# EAGLE design jlink-ob (EAGLE 6.4)
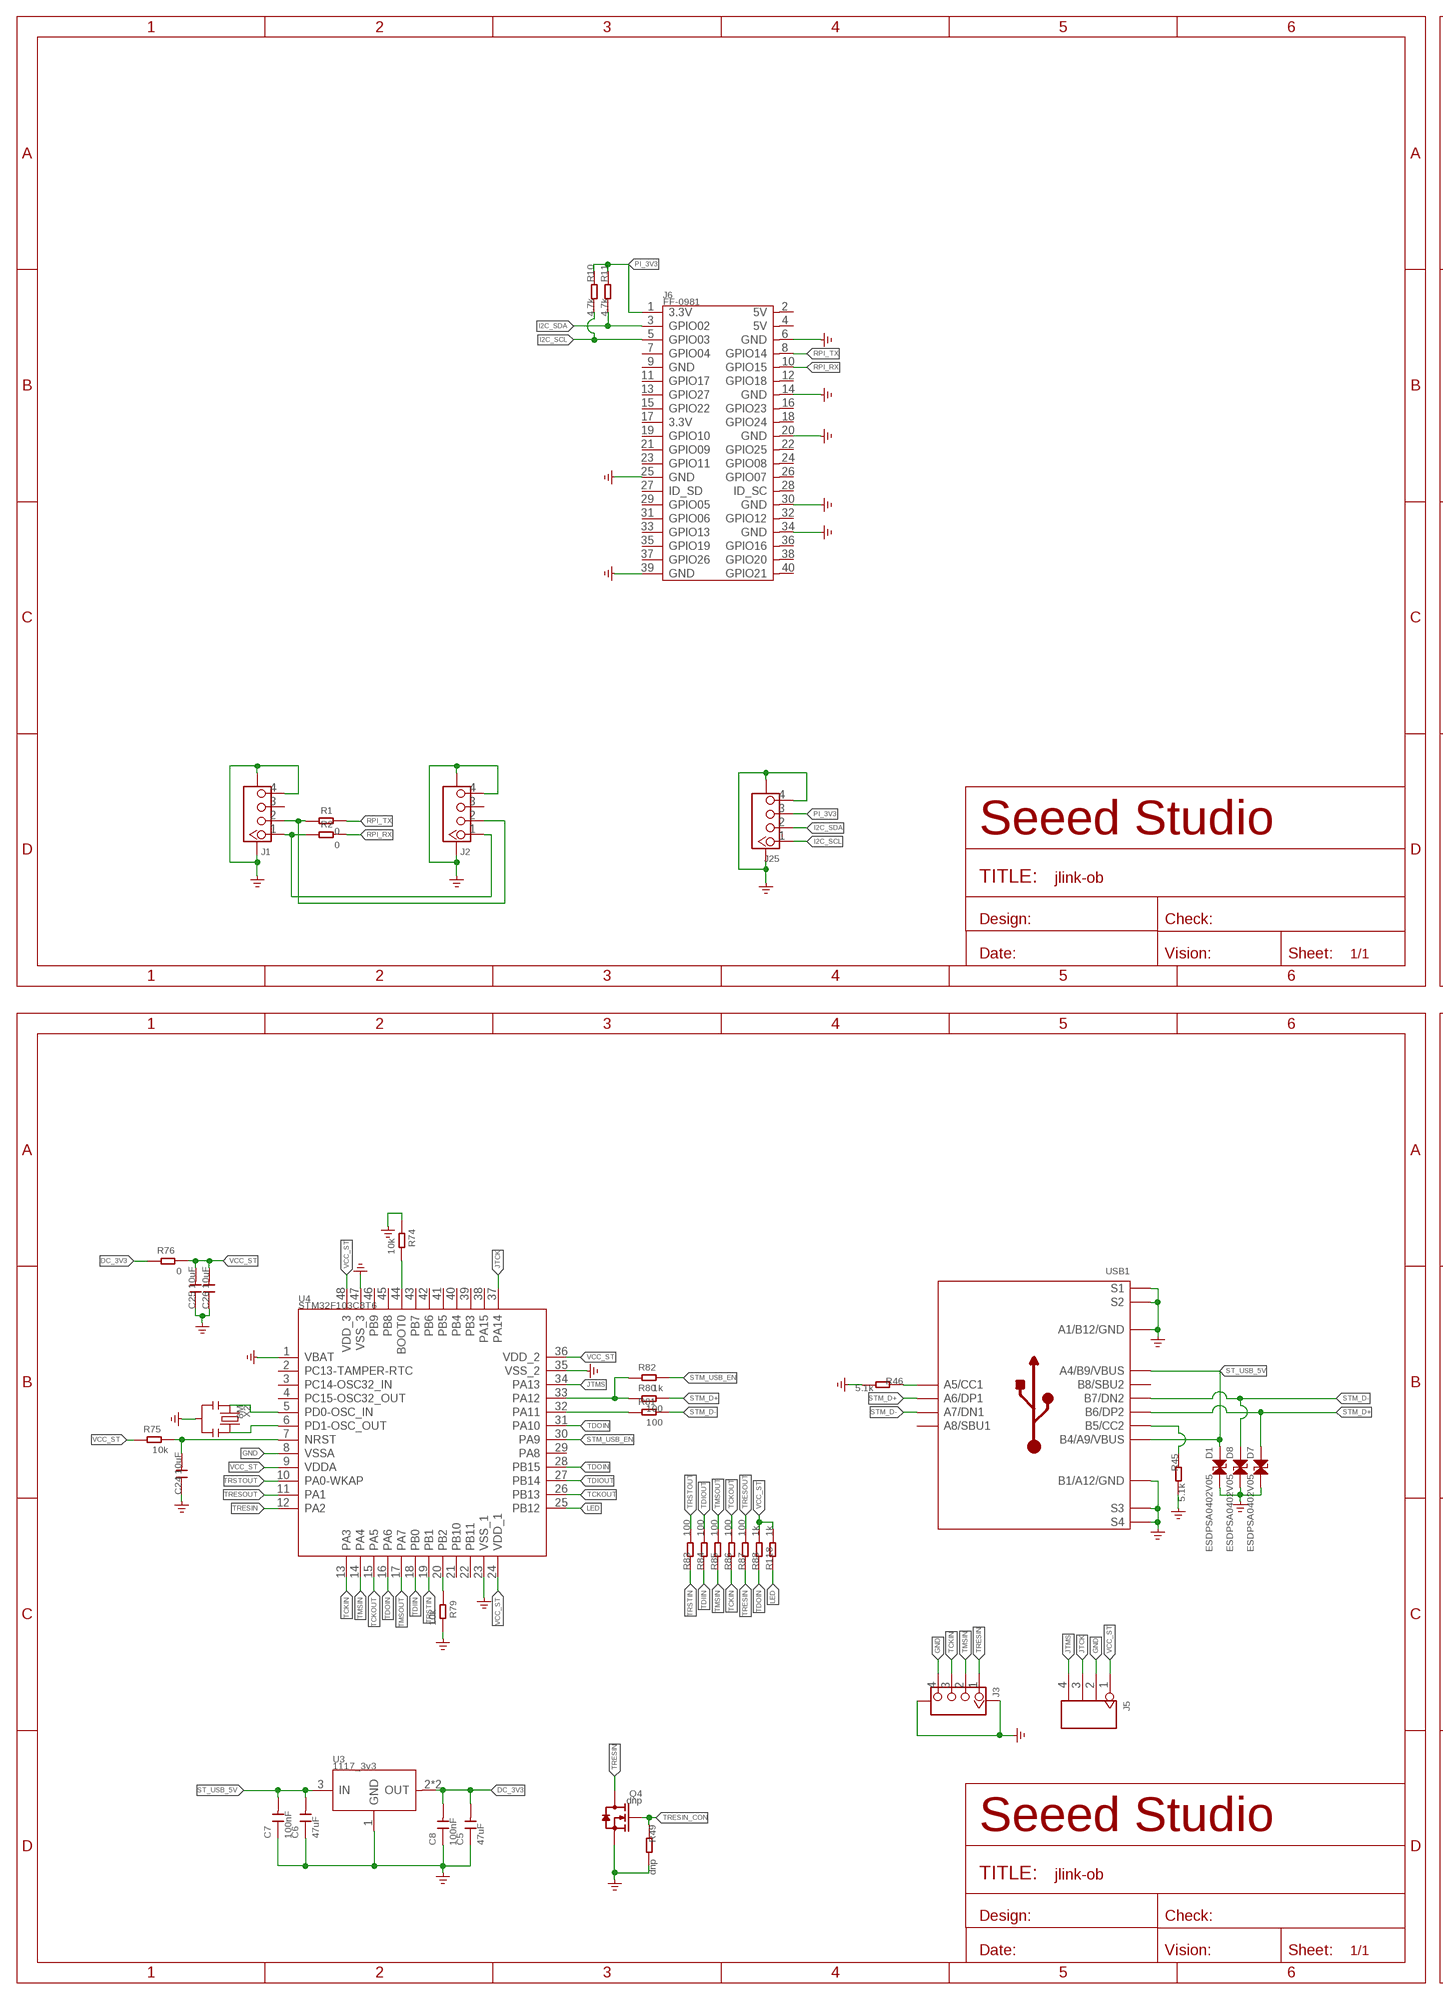
[diagram p0: schematic, sheet 1, part 1 of 2]
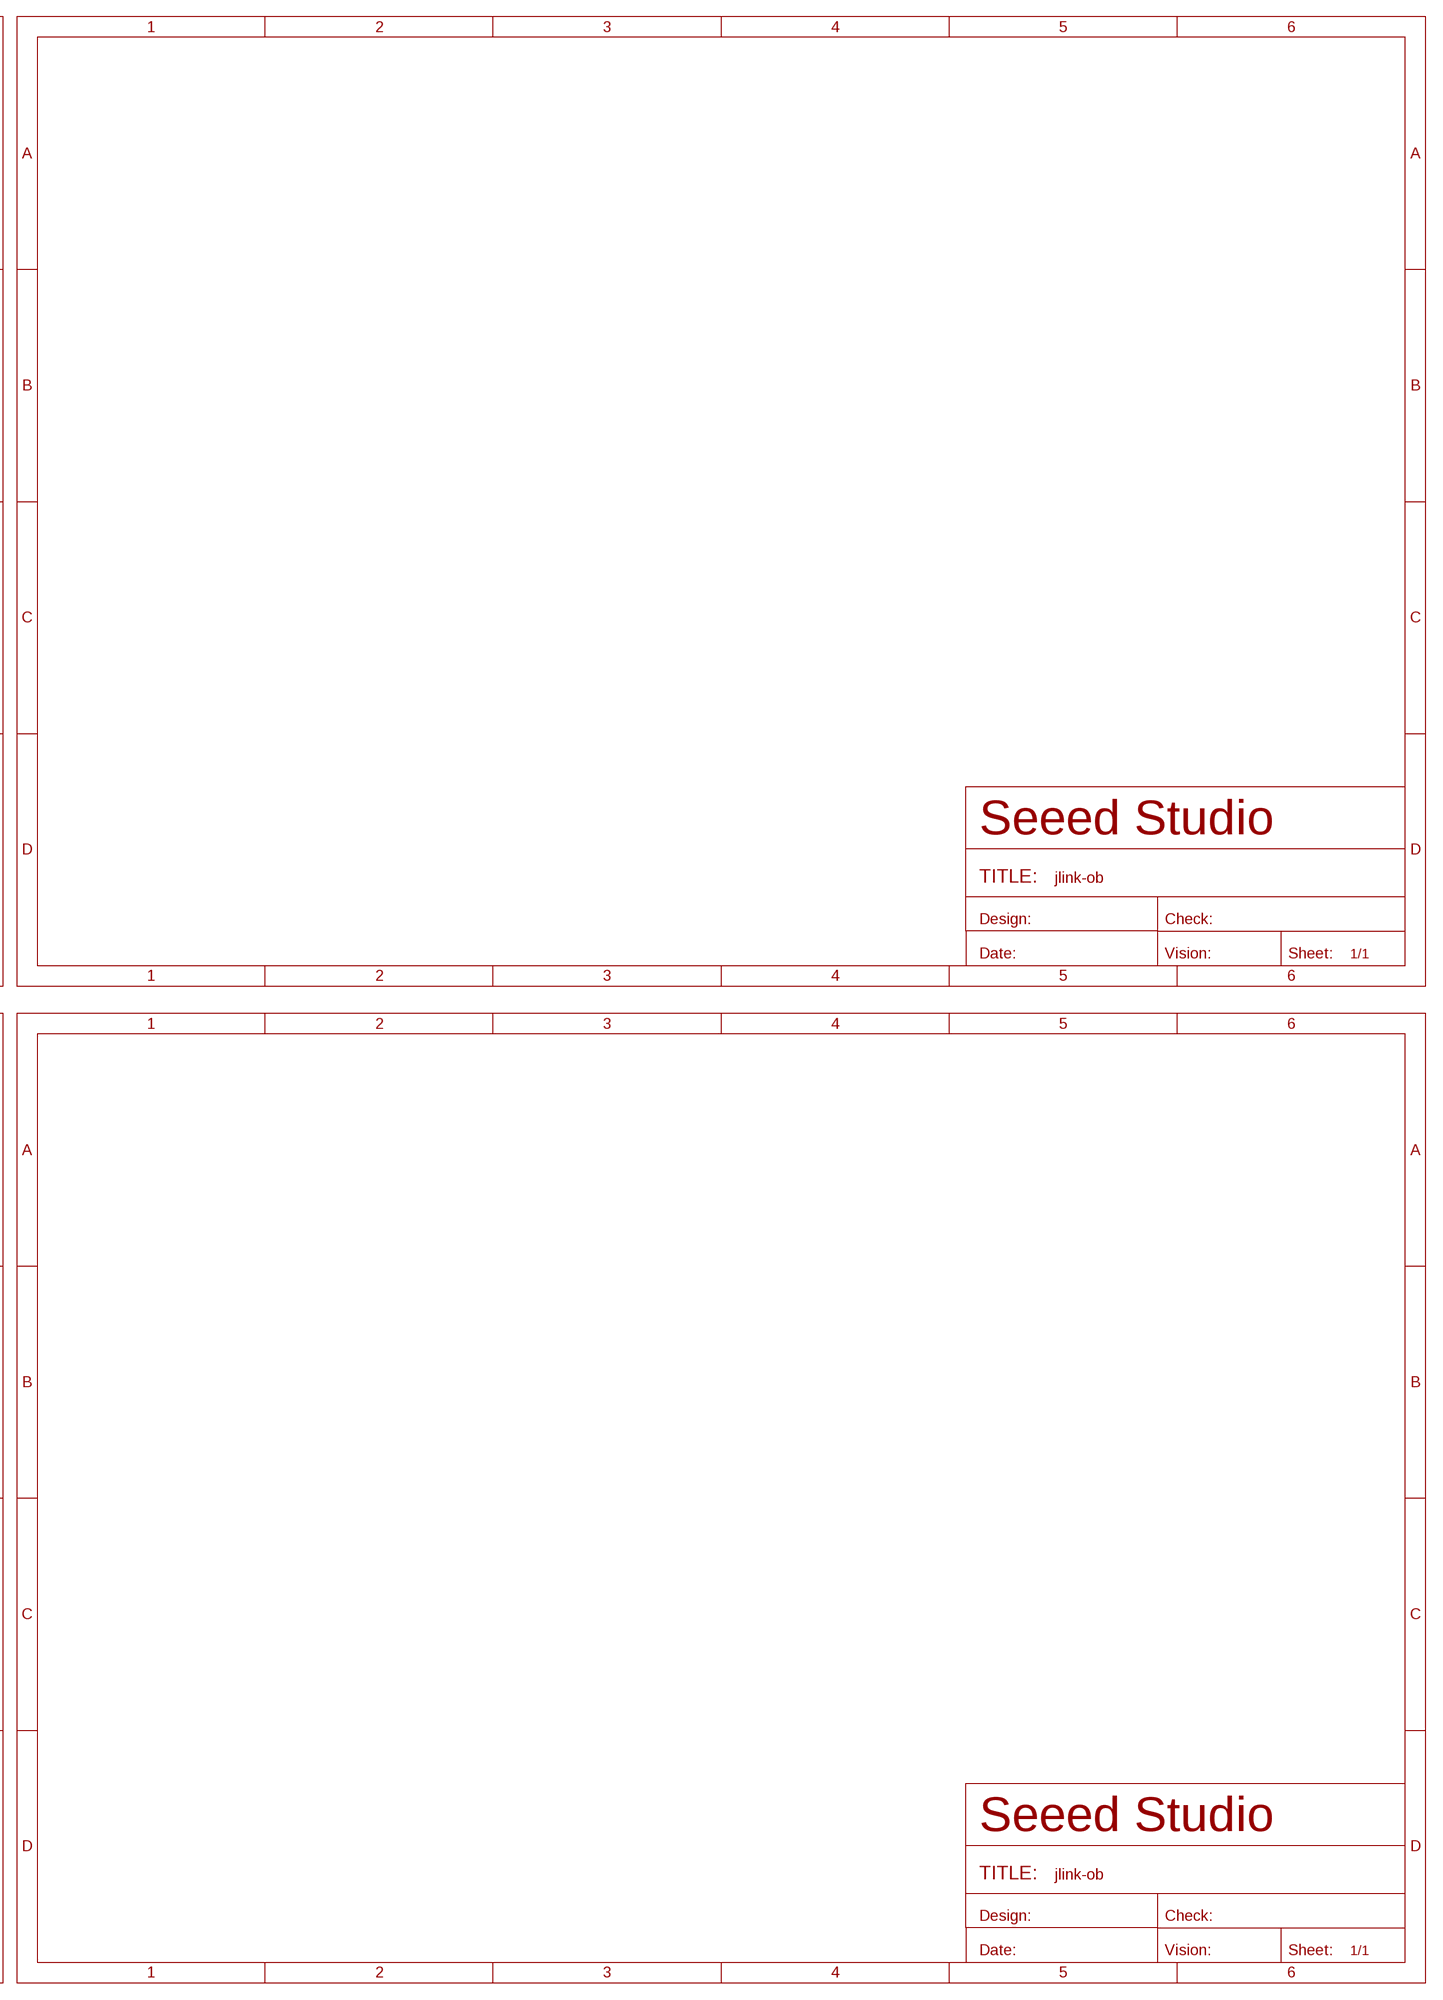
[diagram p1: schematic, sheet 1, part 2 of 2]

## Parts
C5  47uF  CAP-1206  [C1206]
C6  47uF  CAP-1206  [C1206]
C7  100nF  CAP-0603  [C0603]
C8  100nF  CAP-0603  [C0603]
C24  10uF  C-0603  [C0603]
C25  10uF  C-0603  [C0603]
C26  10uF  C-0603  [C0603]
D1  ESDPSA0402V05  D-ESD-2P-DOUBLE-0402  [ESD-0402]
D7  ESDPSA0402V05  D-ESD-2P-DOUBLE-0402  [ESD-0402]
D8  ESDPSA0402V05  D-ESD-2P-DOUBLE-0402  [ESD-0402]
J1  GROVE-CONNECTOR-SMD-320110032  [HW4-SMD-2.0-90D]
J2  GROVE-CONNECTOR-SMD-320110032  [HW4-SMD-2.0-90D]
J3  GROVE-CONNECTOR-SMD-320110032  [HW4-SMD-2.0-90D]
J5  HEADER-4P-65/35MIL  [H4-2.54-65/35MIL]
J6  FF-0981  HEADER-2X20P  [H2X20-2.54]
J25  GROVE-CONNECTOR-SMD-320110032  [HW4-SMD-2.0-90D]
Q4  dnp  MOSFET-N-SOT23  [SOT-23]
R1  0  R-0603  [R0603]
R2  0  R-0603  [R0603]
R10  4.7k  RES-0603  [R0603]
R11  4.7k  RES-0603  [R0603]
R45  5.1k  RES-0603  [R0603]
R46  5.1k  RES-0603  [R0603]
R49  dnp  R-0603  [R0603]
R74  10k  R-0603  [R0603]
R75  10k  R-0603  [R0603]
R76  0  R-0603  [R0603]
R79  10k  R-0603  [R0603]
R80  100  R-0603  [R0603]
R81  100  R-0603  [R0603]
R82  1k  R-0603  [R0603]
R83  100  R-0603  [R0603]
R84  100  R-0603  [R0603]
R85  100  R-0603  [R0603]
R86  100  R-0603  [R0603]
R87  100  R-0603  [R0603]
R88  1k  R-0603  [R0603]
R118  1k  R-0603  [R0603]
U3  1117_3v3  PMIC-CJ1117S  [SOT-223]
U4  STM32F103C8T6  MCU-STM32F103CBT6-310010004  [LQFP48]
USB1  USB2.0-TYPE-C-320010698  [USB2.0-TYPE-C]
X2  8M  CRYSTAL-RESONATOR  [RESONATOR3-SMD-3.6X1.3X0.8MM]

## Nets
DC_3V3: C5.2 C8.2 R76.2 U3.2(OUT) U3.TER(OUT)
GND: C5.1 C6.1 C7.1 C8.1 C24.1 C25.1 C26.1 D1.2 D7.2 D8.2 J1.4 J1.SS1 J1.SS2 J2.4 J2.SS1 J2.SS2 J3.4 J3.SS1 J3.SS2 J5.2 J6.6(GND) J6.14(GND) J6.20(GND) J6.25(GND) J6.30(GND) J6.34(GND) J6.39(GND) J25.4 J25.SS1 J25.SS2 Q4.2(S) R45.2 R46.2 R49.2 R74.2 R79.1 U3.1(GND) U4.1(VBAT) U4.8(VSSA) U4.23(VSS_1) U4.35(VSS_2) U4.47(VSS_3) USB1.A1_B12(A1/B12/GND) USB1.B1_A12(B1/A12/GND) USB1.S1 USB1.S2 USB1.S3 USB1.S4 USB1.S5(S1) USB1.S6(S2) X2.2 ; supply symbol labelled GND_POWER
I2C_SCL: J6.5(GPIO03) J25.1 R10.1
I2C_SDA: J6.3(GPIO02) J25.2 R11.1
JTCK: J5.3 U4.37(PA14)
JTMS: J5.4 U4.34(PA13)
LED: R118.1 U4.25(PB12)
N$2: J1.1 J2.1 R2.2
N$3: J1.2 J2.2 R1.2
N$30: R46.1 USB1.A5(A5/CC1)
N$31: R45.1 USB1.B5(B5/CC2)
N$68: R80.2 R82.2 U4.33(PA12)
N$69: R81.2 U4.32(PA11)
N$71: U4.5(PD0-OSC_IN) X2.1
N$72: U4.6(PD1-OSC_OUT) X2.3
N$75: R79.2 U4.20(PB2)
N$80: R74.1 U4.44(BOOT0)
N$81: C24.2 R75.1 U4.7(NRST)
PI_3V3: J6.1(3.3V) J25.3 R10.2 R11.2
RPI_RX: J6.10(GPIO15) R2.1
RPI_TX: J6.8(GPIO14) R1.1
ST_USB_5V: C6.2 C7.2 D1.1 U3.3(IN) USB1.A4_B9(A4/B9/VBUS) USB1.B4_A9(B4/A9/VBUS)
STM_D+: D7.1 R80.1 USB1.A6(A6/DP1) USB1.B6(B6/DP2)
STM_D-: D8.1 R81.1 USB1.A7(A7/DN1) USB1.B7(B7/DN2)
STM_USB_EN: R82.1 U4.30(PA9)
TCKIN: J3.3 R86.1 U4.13(PA3)
TCKOUT: R86.2 U4.15(PA5) U4.26(PB13)
TDIIN: R84.1 U4.18(PB0)
TDIOUT: R84.2 U4.27(PB14)
TDOIN: R88.1 U4.16(PA6) U4.28(PB15) U4.31(PA10)
TMSIN: J3.2 R85.1 U4.14(PA4)
TMSOUT: R85.2 U4.17(PA7)
TRESIN: J3.1 Q4.3(D) R87.1 U4.12(PA2)
TRESIN_CON: Q4.1(G) R49.1
TRESOUT: R87.2 U4.11(PA1)
TRSTIN: R83.1 U4.19(PB1)
TRSTOUT: R83.2 U4.10(PA0-WKAP)
VCC_ST: C25.2 C26.2 J5.1 R75.2 R76.1 R88.2 R118.2 U4.9(VDDA) U4.24(VDD_1) U4.36(VDD_2) U4.48(VDD_3)
Unconnected: J1.3 J2.3 J6.2(5V) J6.4(5V) J6.7(GPIO04) J6.9(GND) J6.11(GPIO17) J6.12(GPIO18) J6.13(GPIO27) J6.15(GPIO22) J6.16(GPIO23) J6.17(3.3V) J6.18(GPIO24) J6.19(GPIO10) J6.21(GPIO09) J6.22(GPIO25) J6.23(GPIO11) J6.24(GPIO08) J6.26(GPIO07) J6.27(ID_SD) J6.28(ID_SC) J6.29(GPIO05) J6.31(GPIO06) J6.32(GPIO12) J6.33(GPIO13) J6.35(GPIO19) J6.36(GPIO16) J6.37(GPIO26) J6.38(GPIO20) J6.40(GPIO21) U4.2(PC13-TAMPER-RTC) U4.3(PC14-OSC32_IN) U4.4(PC15-OSC32_OUT) U4.21(PB10) U4.22(PB11) U4.29(PA8) U4.38(PA15) U4.39(PB3) U4.40(PB4) U4.41(PB5) U4.42(PB6) U4.43(PB7) U4.45(PB8) U4.46(PB9) USB1.A8(A8/SBU1) USB1.B8(B8/SBU2)

## Library data of the parts
C5-C8 = Discrete-new:CAP: Ceramic Capacitors
C24-C26 = Discrete:C*: Ceramic Capacitors
D1 D7 D8 = Discrete-new:D-ESD-2P-DOUBLE
J1-J3 J25 = Connector-new:GROVE-CONNECTOR-SMD
J5 = Connector-new:HEADER-4P
J6 = Connector-new:HEADER-2X20P
Q4 = Discrete-new:MOSFET-N: IRLL014: http://www.vishay.com/docs/91319/sihll014.pdf
R1 R2 R49 R74-R76 R79-R88 R118 = Discrete:R*
R10 R11 R45 R46 = Discrete-new:RES
U3 = PMIC:PMIC-CJ*1117: Low Drop Fixed And Adjustable Positive Voltage Regulators http://www.datasheetcatalog.org/datasheet/SGSThomsonMicroelectronics/mXuqtqv.pdf
U4 = IC-new:MCU-STM32F103CBT6
USB1 = Connector-new:USB2.0-TYPE-C
X2 = Discrete-new:CRYSTAL-RESONATOR: Resonator Small SMD resonator. This is the itty bitty 10/20MHz resonators with built in caps. CSTCE10M0G55 and CSTCE20M0V53. Footprint has been reviewed closely but hasn't been tested yet.

## Net classes
3 usbvcc: width 0.203 mm, drill 0.305 mm, clearance 0.203 mm

## Board
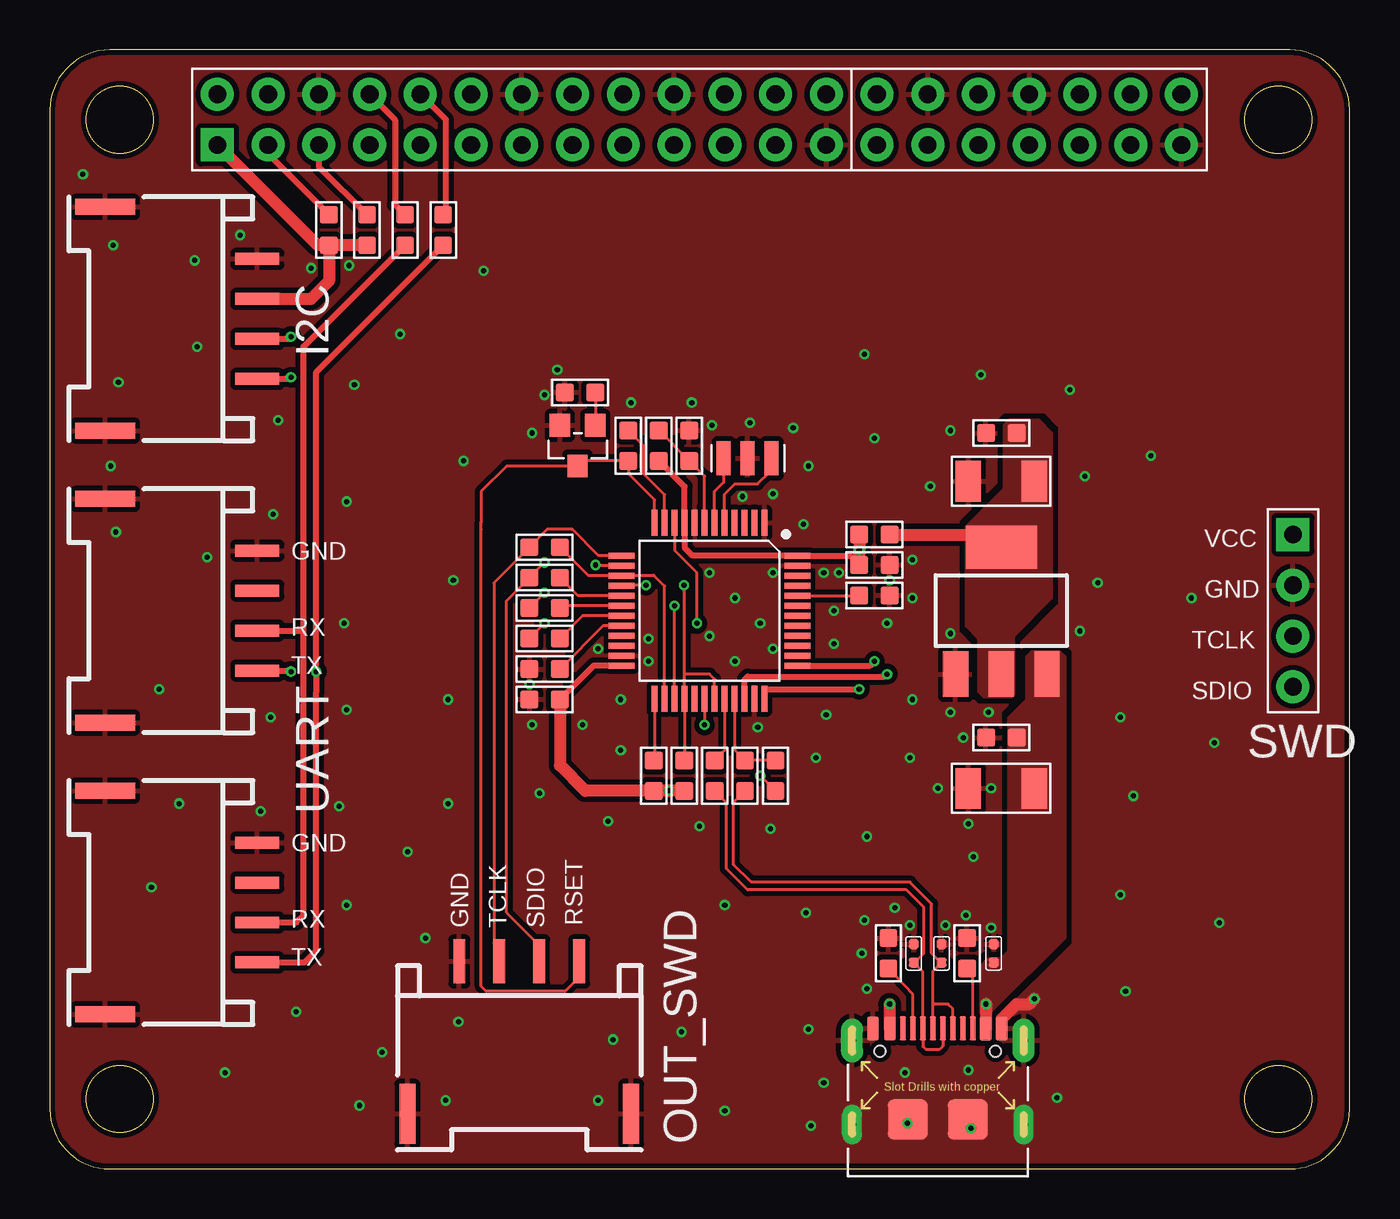
[diagram p2: board, top side]
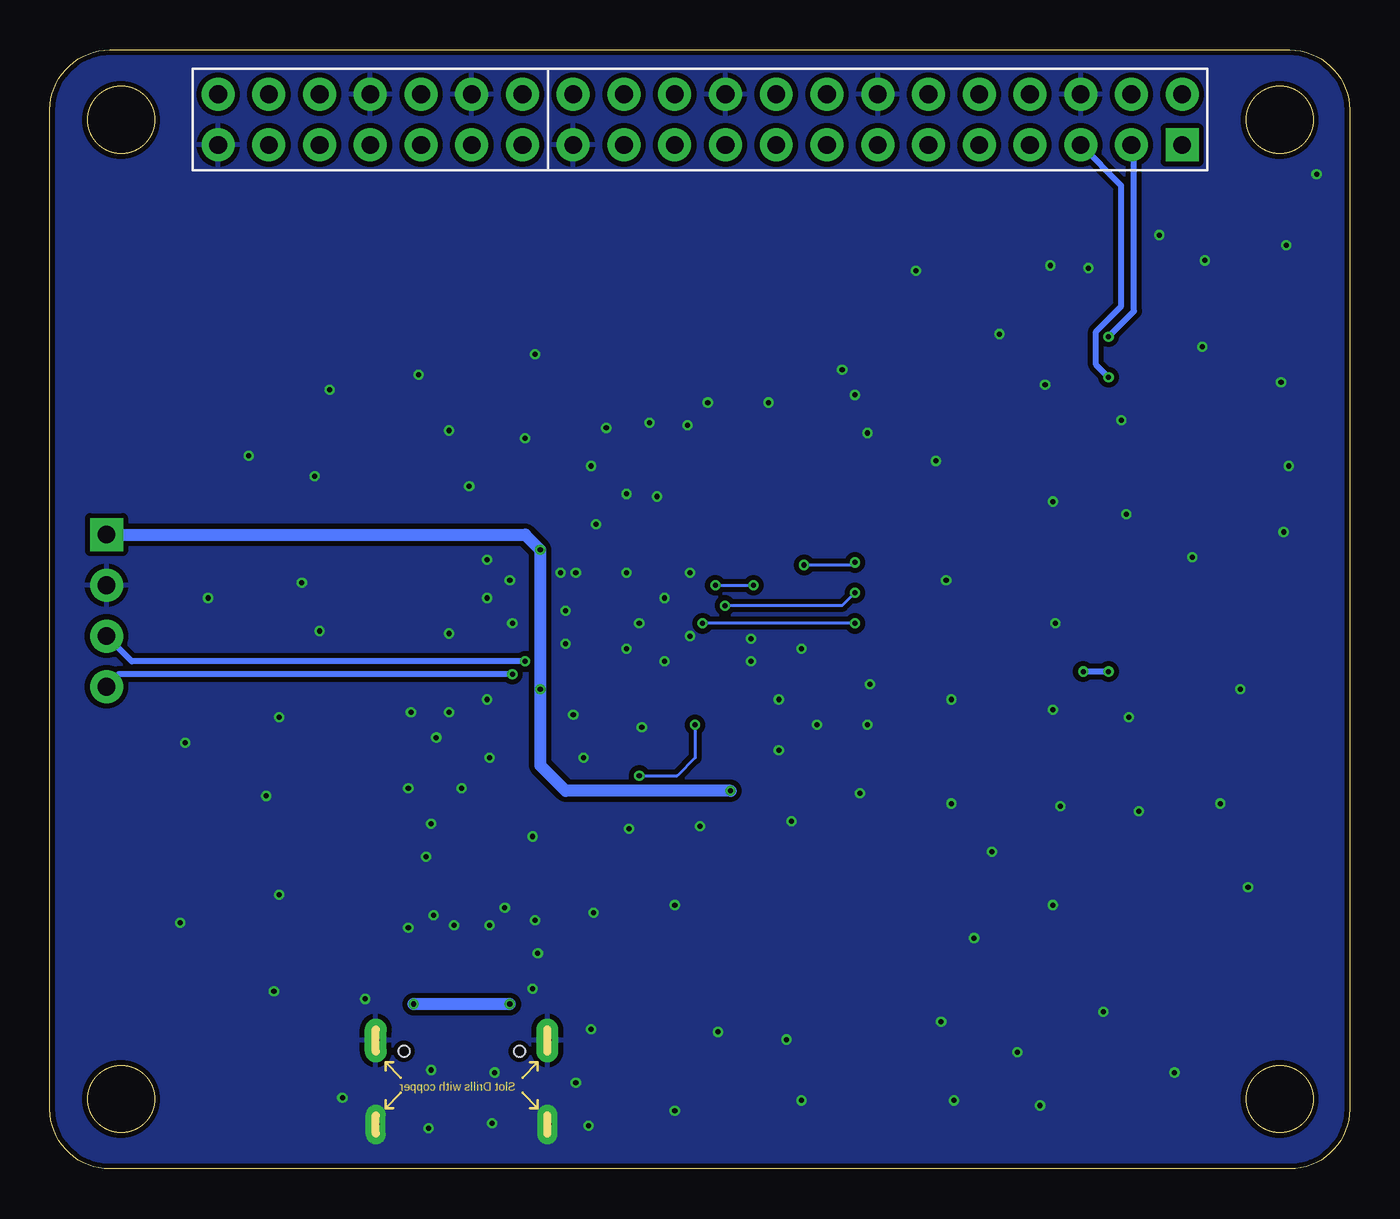
[diagram p3: board, bottom side, seen from below]

Size 65.06 x 56 mm. Coordinates in mm from the lower left corner, seen from the top.
Outline: 3,0 62.06,0 arc90 65.06,3 65.06,53 arc90 62.06,56 3,56 arc90 0,53 0,3 arc90 3,0
Outline: circle at 3.5,3.5 radius 1.68
Outline: circle at 61.5,3.5 radius 1.68
Outline: circle at 61.5,52.5 radius 1.68
Outline: circle at 3.5,52.5 radius 1.68
Copper layers (1*16): Top 0.035mm / dielectric 1.5mm / Bottom 0.035mm
Design rules "SeeedStudio_2layer_DRU_no_angle_20140221": minimum track width 1mil, minimum drill 10mil, track to track 6mil, track to pad 6mil, pad to pad 6mil, via to via 6mil, smd to smd 0mil, copper to edge 10mil, drill to drill 10mil, minimum pad ring 4mil, minimum via ring 4mil, stop-mask expansion 2mil, vias tented up to drill 25mil, thermal gap 10mil

### Footprints (pad centres in the part's own frame; a part is rotated, then mirrored left to right if it is on the bottom)
C1206 = smd 1.27 x 2.032: 1 -1.651,0; 2 1.651,0
C0603 = smd 0.889 x 0.889: 1 0,0.762; 2 0,-0.762
C0603' = smd 0.889 x 0.889: 1 -0.762,0; 2 0.762,0
ESD-0402 = smd 0.5 x 0.5: 1 -0.463,0; 2 0.463,0
HW4-SMD-2.0-90D = smd 0.6 x 2.2: 1 -3,-0.225; 2 -1,-0.225; 3 1,-0.225; 4 3,-0.225 | smd 0.8 x 3: SS1 -5.6,7.4; SS2 5.6,7.4
H4-2.54-65/35MIL = drill 0.889 pad 1.651 square: 1 0,3.81 | drill 0.889 pad 1.651: 2 0,1.27; 3 0,-1.27; 4 0,-3.81
H2X20-2.54 = drill 0.889 pad 1.651 square: 1 1.27,24.13 | drill 0.889 pad 1.651: 2 -1.27,24.13; 3 1.27,21.59; 4 -1.27,21.59; 5 1.27,19.05; 6 -1.27,19.05; 7 1.27,16.51; 8 -1.27,16.51; 9 1.27,13.97; 10 -1.27,13.97; 11 1.27,11.43; 12 -1.27,11.43; 13 1.27,8.89; 14 -1.27,8.89; 15 1.27,6.35; 16 -1.27,6.35; 17 1.27,3.81; 18 -1.27,3.81; 19 1.27,1.27; 20 -1.27,1.27; 21 1.27,-1.27; 22 -1.27,-1.27; 23 1.27,-3.81; 24 -1.27,-3.81; 25 1.27,-6.35; 26 -1.27,-6.35; 27 1.27,-8.89; 28 -1.27,-8.89; 29 1.27,-11.43; 30 -1.27,-11.43; 31 1.27,-13.97; 32 -1.27,-13.97; 33 1.27,-16.51; 34 -1.27,-16.51; 35 1.27,-19.05; 36 -1.27,-19.05; 37 1.27,-21.59; 38 -1.27,-21.59; 39 1.27,-24.13; 40 -1.27,-24.13
SOT-23 = smd 1.143 x 1.016: 1 1.016,-0.889; 2 1.016,0.889; 3 -1.016,0
R0603 = smd 0.889 x 0.889: 1 -0.762,0; 2 0.762,0
R0603' = smd 0.889 x 0.889: 1 0,0.762; 2 0,-0.762
SOT-223 = smd 1.27 x 2.286: 1 -2.286,-3.175; 2 0,-3.175; 3 2.286,-3.175 | smd 3.556 x 2.159: TER 0,3.175
LQFP48 = smd 0.3 x 1.3: 1 -2.75,-4.4; 2 -2.25,-4.4; 3 -1.75,-4.4; 4 -1.25,-4.4; 5 -0.75,-4.4; 6 -0.25,-4.4; 7 0.25,-4.4; 8 0.75,-4.4; 9 1.25,-4.4; 10 1.75,-4.4; 11 2.25,-4.4; 12 2.75,-4.4; 25 2.75,4.4; 26 2.25,4.4; 27 1.75,4.4; 28 1.25,4.4; 29 0.75,4.4; 30 0.25,4.4; 31 -0.25,4.4; 32 -0.75,4.4; 33 -1.25,4.4; 34 -1.75,4.4; 35 -2.25,4.4; 36 -2.75,4.4 | smd 1.3 x 0.3: 13 4.4,-2.75; 14 4.4,-2.25; 15 4.4,-1.75; 16 4.4,-1.25; 17 4.4,-0.75; 18 4.4,-0.25; 19 4.4,0.25; 20 4.4,0.75; 21 4.4,1.25; 22 4.4,1.75; 23 4.4,2.25; 24 4.4,2.75; 37 -4.4,2.75; 38 -4.4,2.25; 39 -4.4,1.75; 40 -4.4,1.25; 41 -4.4,0.75; 42 -4.4,0.25; 43 -4.4,-0.25; 44 -4.4,-0.75; 45 -4.4,-1.25; 46 -4.4,-1.75; 47 -4.4,-2.25; 48 -4.4,-2.75
USB2.0-TYPE-C = smd 1.2 x 0.6: A1_B12 0.05,3.25; A4_B9 0.05,2.4; B1_A12 0.05,-3.2; B4_A9 0.05,-2.4 | smd 1.2 x 0.3: A5 0.05,1.25; A6 0.05,0.25; A7 0.05,-0.25; A8 0.05,-1.25; B5 0.05,-1.75; B6 0.05,-0.75; B7 0.05,0.75; B8 0.05,1.75 | drill 0.4 pad 1 long: S1 -4.75,4.3; S2 -4.75,-4.3 | drill 0.4 pad 1.1 long: S3 -0.55,4.3; S4 -0.55,-4.3 | smd 2 x 2: S5 -4.5,1.5; S6 -4.5,-1.5 | hole 0.55: -1.1,-2.89; -1.1,2.89
RESONATOR3-SMD-3.6X1.3X0.8MM = smd 0.7 x 1.7: 1 -1.2,0; 2 0,0; 3 1.2,0

### Placement (x,y rotation side)
C5  47.62,34.42 0 top
C6  47.62,19.05 0 top
C7  47.62,21.59 90 top
C8  47.62,36.83 90 top
C24  10uF  [C0603']  32,36.2 270 top
C25  10uF  [C0603']  41.27,30.23 180 top
C26  10uF  [C0603']  24.77,23.5 0 top
D1  47.24,10.79 90 top
D7  44.64,10.79 90 top
D8  43.24,10.79 90 top
J1  10.16,27.94 90 top
J2  10.16,13.34 90 top
J3  23.5,10.16 180 top
J5  62.23,27.94 0 top
J6  32.51,52.51 270 bottom
J25  10.16,42.55 90 top
Q4  26.42,36.2 90 top
R1  17.78,46.99 270 top
R2  19.68,46.99 270 top
R10  4.7k  [R0603']  15.88,46.99 0 top
R11  4.7k  [R0603']  13.97,46.99 0 top
R45  5.1k  [R0603']  45.91,10.79 180 top
R46  5.1k  [R0603']  41.97,10.79 180 top
R49  26.54,38.86 180 top
R74  41.27,28.7 0 top
R75  30.48,36.2 270 top
R76  41.27,31.75 0 top
R79  24.77,25.02 0 top
R80  34.8,19.68 90 top
R81  33.27,19.68 90 top
R82  36.32,19.68 90 top
R83  24.77,26.54 180 top
R84  24.77,28.07 180 top
R85  24.77,29.59 0 top
R86  24.77,31.11 0 top
R87  28.96,36.2 90 top
R88  31.75,19.68 270 top
R118  30.23,19.68 270 top
U3  47.62,27.94 0 top
U4  33.02,27.94 180 top
USB1  44.45,6.99 90 top
X2  34.92,35.56 180 top

### Tracks (layer width: path | path; a pad name or v marks a point on that pad's centre or on a via)
DC_3V3
  Top 0.61: R76.2 46.99,31.75 U3.TER
  pour Top (isolate 0.254, no thermals): 46.74,23.62 48.13,23.62 48.26,23.75 48.26,26.67 50.16,28.57 50.16,36.83 49.53,37.47 48.01,37.47 47.75,37.21 47.75,34.04 45.85,32.13 45.85,27.18 46.48,26.54 46.48,23.88
GND  (via drill 0.25 pad 0.51)
  Top 0.61: USB1.B1_A12 47.65,7.52 48.39,8.26 49.02,8.26 v49.28,8.51
  other vias: 24.77,38.73 25.4,40.01 24.13,36.83 24,24.26 27.43,26.04 29.97,26.54 29.97,25.4 28.57,23.5 28.57,20.95 26.67,22.23 24.13,22.23 38.73,29.84 39.5,29.84 36.2,29.84 36.2,26.04 34.29,25.4 33.02,26.67 33.02,29.84 34.29,28.57 35.56,27.3 39.24,27.94 39.24,26.29 42.04,29.46 43.18,30.48 43.18,28.57 41.91,27.3 46.99,22.86 45.09,22.86 43.18,23.5 45.09,26.8 45.72,21.59 47.12,19.05 45.97,17.27 44.45,19.05 44.83,12.19 45.85,12.7 47.12,12.06 43.05,12.19 42.29,13.08 40.77,12.45 40.64,10.79 40.89,9.02 42.8,4.83 45.97,4.95 50.42,3.56 46.1,2.03 42.93,2.29 38.73,4.32 38.1,2.16 37.97,6.99 46.23,15.62 36.07,17.02 40.89,16.64 37.85,12.83 33.78,13.21 32.51,17.14 35.43,22.1 38.86,22.73 38.35,20.57 43.05,20.57 24.51,18.8 27.94,17.4 31.62,6.86 33.78,2.92 28.19,6.48 27.43,3.43 19.81,3.43 20.45,7.37 17.91,15.88 18.8,11.56 16.64,5.84 15.49,3.17 10.54,17.91 11.05,22.61 6.48,18.29 5.08,14.1 8.76,4.83 12.32,7.87 5.46,24 3.3,31.88 3.05,35.18 3.43,39.37 3.17,46.23 1.65,49.78 9.53,46.74 13.08,45.09 14.99,45.21 7.24,45.47 11.43,37.47 11.18,32.77 7.87,30.61 7.37,41.15 21.72,44.96 17.53,41.78 15.24,39.24 14.86,33.4 14.73,27.3 14.86,22.99 14.48,18.16 14.86,13.21 19.94,18.29 19.94,23.5 20.19,29.46 20.7,35.43 29.08,38.35 32.13,38.35 35.05,37.34 33.15,37.21 37.21,37.08 34.67,33.66 36.2,33.78 37.72,32.26 37.97,35.18 45.09,36.96 44.07,34.16 46.61,39.75 40.77,40.77 41.27,36.58 51.05,38.99 51.82,34.67 52.45,29.34 51.56,26.92 57.15,28.57 55.12,35.69 53.59,22.61 58.29,21.34 54.23,18.67 53.59,13.72 53.85,8.89 58.55,12.32
  pour Top (isolate 0.254, rank 6): 0,56.52 65.41,56.52 65.41,0 0,0
  pour Bottom (isolate 0.254, rank 6): 0,56.52 65.41,56.52 65.41,0 0,0
I2C_SCL  (via drill 0.25 pad 0.51)
  Top 0.305: J6.5 13.46,50.16 R10.1 | J25.1 11.99,39.55 v12.06,39.62
  Bottom 0.305: v12.06,39.62 12.7,40.26 12.7,41.91 11.43,43.18 11.43,49.21 J6.5
I2C_SDA  (via drill 0.25 pad 0.51)
  Top 0.305: J6.3 10.92,50.8 R11.1 | J25.2 11.95,41.55 v12.06,41.66
  Bottom 0.305: v12.06,41.66 10.79,42.93 10.79,51.12 J6.3
JTCK  (via drill 0.25 pad 0.51)
  Top 0.305: U4.37 41.06,25.19 v41.27,25.4
  Bottom 0.305: v41.27,25.4 60.96,25.4 J5.3
JTMS  (via drill 0.25 pad 0.51)
  Top 0.305: U4.34 34.77,24.48 34.92,24.64 41.78,24.64 v41.91,24.77
  Bottom 0.305: v41.91,24.77 61.59,24.77 J5.4
LED
  Top 0.152: U4.25 30.27,20.49 R118.1
N$2  (via drill 0.25 pad 0.51)
  Top 0.305: J2.1 12.75,10.34 13.34,10.92 13.34,23.88 v13.34,24.89 13.34,39.88 R2.2 | J1.1 12.02,24.94 v12.06,24.89
  Bottom 0.305: v12.06,24.89 v13.34,24.89
N$3
  Top 0.305: J2.2 12.34,12.34 12.7,12.7 12.7,27.05 | 12.7,27.05 12.7,41.15 R1.2 | J1.2 12.59,26.94 12.7,27.05
N$30
  Top 0.152: USB1.A5 43.2,8.74 R46.1
N$31
  Top 0.152: USB1.B5 46.2,9.68 R45.1
N$68
  Top 0.152: U4.33 34.27,20.98 R80.2 R82.2
N$69
  Top 0.152: U4.32 33.77,20.94 R81.2
N$71
  Top 0.152: U4.5 33.77,33.77 34.29,34.29 35.43,34.29 36.07,34.92 36.07,35.5 X2.1
N$72
  Top 0.152: U4.6 33.27,33.91 33.73,34.36 X2.3
N$75
  Top 0.152: U4.20 27.7,27.19 R79.2
N$80
  Top 0.152: U4.44 R74.1
N$81
  Top 0.152: U4.7 32.77,34.67 C24.2 R75.1
PI_3V3
  Top 0.61: R10.2 R11.2 | R11.2 13.4,46.23 J6.1 | R11.2 13.97,44.45 13.06,43.55 J25.3
RPI_RX
  Top 0.305: J6.10 18.55,53.78 19.81,52.53 19.81,47.88 R2.1
RPI_TX
  Top 0.305: J6.8 17.27,52.5 17.27,48.26 R1.1
ST_USB_5V  (via drill 0.25 pad 0.51)
  Top 0.61: USB1.A4_B9 42.05,8.24 v42.04,8.26 | v46.86,8.26 46.86,7.05 USB1.B4_A9
  Bottom 0.61: v42.04,8.26 v46.86,8.26
  pour Top (isolate 0.254, no thermals): 46.61,6.48 46.61,10.16 46.99,10.54 47.62,10.54 48.01,10.92 48.01,22.61 48.9,23.5 48.9,25.65 49.15,25.91 50.55,25.91 50.8,25.65 50.8,11.56 47.12,7.87 47.12,6.48
STM_D+
  Top 0.152: R80.1 34.23,18.35 34.23,15.23 35.11,14.35 43.05,14.35 44.13,13.27 44.13,10.79 44.59,10.33 D7.1 44.2,9.89 44.2,8.26 | USB1.A6 44.2,8.26 | USB1.B6 45.2,8.01 44.96,8.26 44.2,8.26
STM_D-
  Top 0.152: R81.1 33.85,18.35 33.85,15.05 34.92,13.97 42.88,13.97 43.75,13.1 43.75,10.79 43.29,10.33 D8.1 43.7,9.88 USB1.B7 43.7,6.14 43.87,5.97 44.52,5.97 44.7,6.15 USB1.A7
STM_USB_EN  (via drill 0.25 pad 0.51)
  Top 0.152: R82.1 v35.56,19.68 | U4.30 v32.77,22.23
  Bottom 0.152: v35.56,19.68 33.66,19.68 32.77,20.57 v32.77,22.23
TCKIN
  Top 0.152: U4.13 27.48,30.69 26.16,32 24.89,32 R86.1 22.23,29.34 22.23,11.3 22.61,10.92 22.61,10.5 J3.3
TCKOUT
  Top 0.152: R86.2 26.95,29.69 U4.15 28.67,29.69 28.7,29.72 30.23,29.72 30.77,29.17 U4.26
TDIIN
  Top 0.152: U4.18 25.65,28.19 R84.1
TDIOUT  (via drill 0.25 pad 0.51)
  Top 0.152: R84.2 v24.77,28.83 | U4.27 31.27,28.17 v31.27,28.19
  Bottom 0.152: v24.77,28.83 25.4,28.19 v31.27,28.19
TDOIN  (via drill 0.25 pad 0.51)
  Top 0.152: R88.1 31.77,20.47 U4.28 31.77,24.77 | 31.77,24.77 31.77,29.19 v31.75,29.21 | v29.84,29.21 28.64,29.21 U4.16 | U4.31 33.27,24.52 33.02,24.77 31.77,24.77
  Bottom 0.152: v31.75,29.21 v29.84,29.21
TMSIN  (via drill 0.25 pad 0.51)
  Top 0.152: J3.2 24.38,10.5 24.38,11.3 22.86,12.83 22.86,28.45 R85.1 v24.77,30.35 | U4.14 27.34,30.19 v27.3,30.23
  Bottom 0.152: v27.3,30.23 24.89,30.23 v24.77,30.35
TMSOUT
  Top 0.152: U4.17 26.43,28.69 R85.2
TRESIN
  Top 0.152: U4.12 30.27,33.48 28.96,34.8 R87.1 26.67,35.43 Q4.3 22.86,35.18 21.59,33.91 21.59,32.38 21.59,32 21.59,9.14 21.84,8.89 25.78,8.89 26.5,9.6 J3.1
TRESIN_CON
  Top 0.152: R49.1 Q4.1
TRESOUT
  Top 0.152: U4.11 30.77,33.75 29.72,34.8 29.72,36.2 R87.2
TRSTIN
  Top 0.152: U4.19 26.67,27.69 R83.1
TRSTOUT  (via drill 0.25 pad 0.51)
  Top 0.152: R83.2 v24.77,27.3 | v32.38,27.3 32.38,29.84 31.27,30.96 U4.10
  Bottom 0.152: v24.77,27.3 v32.38,27.3
VCC_ST  (via drill 0.25 pad 0.51)
  Top 0.305: R75.2 31.77,34.14 U4.9 31.77,31.09 32.17,30.69 U4.48 40.05,30.69 C25.2 | U4.24 27.22,25.19 C26.2 | U4.36 35.77,23.96 35.81,24 v40.51,24
  Top 0.61: R88.2 v30.99,18.92 R118.2 26.8,18.92 25.53,20.19 C26.2 | R76.1 v40.51,30.99 C25.2
  Bottom 0.61: v30.99,18.92 39.24,18.92 40.51,20.19 v40.51,24 v40.51,30.99 41.27,31.75 J5.1

### Text on the board
tPlace: I2C | VCC | GND | GND | RX | TCLK | TX | SDIO | SWD | UART | GND | RX | GND | TCLK | SDIO | RSET | TX | OUT_SWD
tNames: LAYER STACK-UP - ALL DIMENSIONS IN MIL | 50ohm SINGLE ENDED / IMPEDANCE CONTROL +/-10% | 90ohm SINGLE ENDED / IMPEDANCE CONTROL +/-10% | 100ohm SINGLE ENDED / IMPEDANCE CONTROL +/-10% | TRACE WIDTH | TRACE WIDTH / SPACE | TRACE WIDTH / SPACE | LAYER# | COPPER WEIGHT / (OZ) | LAYER 1 - GTL | HALF+PLATING=1OZ | 23 | Clearance from copper 5mil | 8.8/4.5 | Clearance from copper 5mil | 5.8/4.5 | Clearance from copper 5mil | Clearance from copper 5mil | LAYER 2 - GBL | HALF+PLATING=1OZ | 23 | Clearance from copper 5mil | 8.8/4.5 | Clearance from copper 5mil | 5.8/4.5